# Altium schematic sheet LISC_AFE.SchDoc: LISC
size A4; Date: 2018-04-21; Author: EP; Organization: eptecon; Revision: A; SheetNumber: 3; SheetTotal: 5; PartNumber: 200511-000; DesignStatus: in progress; Project: LISC-XC95144XL; SheetTitle: Analog Frontend; ProjectName: Project Name
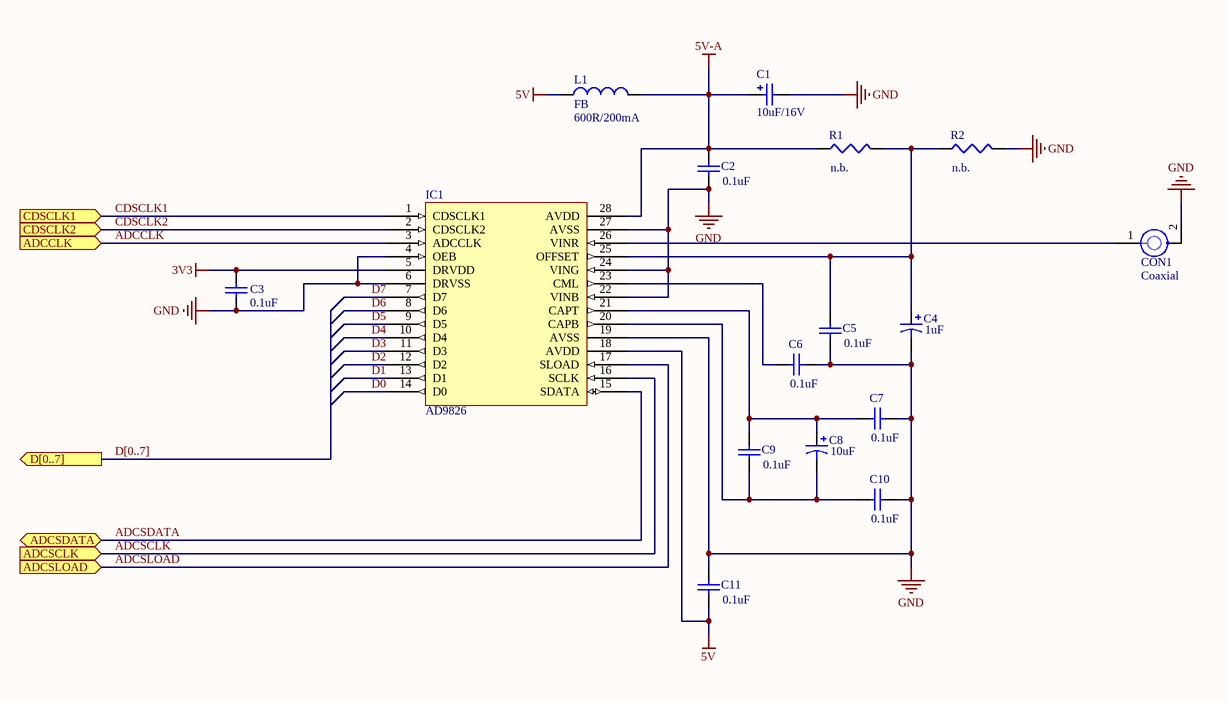
[diagram p0: LISC_AFE.SchDoc]

## Parts
C1  10uF/16V  [C1210 Pol]
C2  value 0.1uF  [1608[0603]]
C3  value 0.1uF  [1608[0603]]  (hidden comment: Cap Semi)
C4  value 1uF  [C0805]
C5  value 0.1uF  [1608[0603]]
C6  value 0.1uF  [1608[0603]]
C7  value 0.1uF  [1608[0603]]
C8  value 10uF  [C0805]
C9  value 0.1uF  [1608[0603]]
C10  value 0.1uF  [1608[0603]]
C11  value 0.1uF  [1608[0603]]
CON1  Coaxial  [U.FL-R-SMT]
IC1  AD9826  [SOP65P780-28AM]
L1  FB  value 600R/200mA  [INDC1608L]
R1  value n.b.  [J1-0603]
R2  value n.b.  [J1-0603]

## Ports
ADCCLK (in), ADCSCLK (in), ADCSDATA (bidir), ADCSLOAD (in), CDSCLK1 (in), CDSCLK2 (in), D[0..7] (out)

## Nets
3V3: C3.1 IC1.5(DRVDD)
5V: C11.1 IC1.18(AVDD) L1.1
5V-A: C1.1 C2.2 IC1.28(AVDD) L1.2 R1.1
GND: C1.2 C2.1 C3.2 C4.2 C5.1 C6.1 C7.1 C10.1 C11.2 CON1.2 IC1.4(OEB) IC1.6(DRVSS) IC1.19(AVSS) IC1.22(VINB) IC1.24(VING) IC1.27(AVSS) R2.2
ADCCLK: IC1.3(ADCCLK) ; port ADCCLK
ADCSCLK: IC1.16(SCLK) ; port ADCSCLK
ADCSDATA: IC1.15(SDATA) ; port ADCSDATA
ADCSLOAD: IC1.17(SLOAD) ; port ADCSLOAD
CDSCLK1: IC1.1(CDSCLK1) ; port CDSCLK1
CDSCLK2: IC1.2(CDSCLK2) ; port CDSCLK2
D0: IC1.14(D0)
D1: IC1.13(D1)
D2: IC1.12(D2)
D3: IC1.11(D3)
D4: IC1.10(D4)
D5: IC1.9(D5)
D6: IC1.8(D6)
D7: IC1.7(D7)
NetC4_1: C4.1 C5.2 IC1.25(OFFSET) R1.2 R2.1
NetC6_2: C6.2 IC1.23(CML)
NetC7_2: C7.2 C8.1 C9.2 IC1.21(CAPT)
NetC8_2: C8.2 C9.1 C10.2 IC1.20(CAPB)
NetCON1_1: CON1.1 IC1.26(VINR)

## Buses and harness runs
bus D[0..7] = port D[0..7]

## Notes on the sheet
- The reproduction, distribution and utilization of this document as well as communication of its content to others without express authorization is prohibited.
- Offenders will be held liable for the payment of damages.
- All rights reserved in the event of the grant of a patent, utility model or design.
- Project:
- Status:
- Created by:
- Reviewed by:
- Date:
- Name:
- Title:
- Part number:
- Revision:
- Size:
- Sheet:
- of:
- Released by:
- A4

## Library data of the parts
C1 = Cap EU SMD Pol: Polarized Capacitor (Surface Mount); Value: 10uF; Published: 8-Jun-2000; LatestRevisionDate: 29-May-2009; LatestRevisionNote: IPC-7351 Footprint Added.; PackageReference: C0805; Publisher: Altium Limited; PackageDescription: Chip Capacitor
C2 C3 C5-C7 C9-C11 = Cap Semi: Capacitor (Semiconductor SIM Model); Published: 8-Jun-2000; LatestRevisionDate: 29-May-2009; LatestRevisionNote: IPC-7351 Footprint Added.; PackageReference: C1206; Publisher: Altium Limited; PackageDescription: Chip Capacitor
C4 C8 = Cap Pol3: Polarized Capacitor (Surface Mount); Published: 8-Jun-2000; LatestRevisionDate: 29-May-2009; LatestRevisionNote: IPC-7351 Footprint Added.; PackageReference: C0805; Publisher: Altium Limited; PackageDescription: Chip Capacitor
L1 = Inductor: Code_IEC: 1005; Published: 8-Jun-2000; LatestRevisionDate: 29-May-2009; LatestRevisionNote: IPC-7351 Footprint Added.; PackageReference: 0402-A; Publisher: Altium Limited; PackageDescription: Chip Inductor; Code_JEITA: 0402
R1 R2 = Res3: Resistor; Published: 8-Jun-2000; LatestRevisionDate: 29-May-2009; LatestRevisionNote: IPC-7351 Footprint Added.; PackageReference: J1-0603; Publisher: Altium Limited; PackageDescription: Chip Resistor